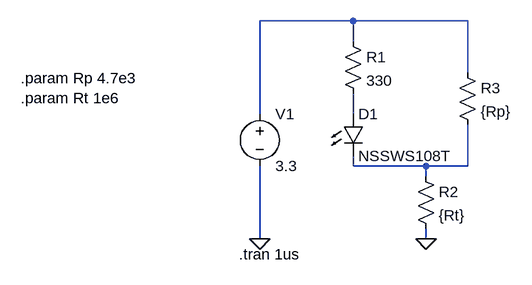
[diagram p0: schematic GpioLedWithPullup.asc]
GpioLedWithPullup.asc, the LTspice schematic file:
Version 4
SHEET 1 880 680
WIRE 192 -16 48 -16
WIRE 368 -16 192 -16
WIRE 192 16 192 -16
WIRE 368 64 368 -16
WIRE 48 128 48 -16
WIRE 192 128 192 96
WIRE 192 208 192 192
WIRE 304 208 192 208
WIRE 368 208 368 144
WIRE 368 208 304 208
WIRE 304 224 304 208
WIRE 48 320 48 208
WIRE 304 320 304 304
FLAG 48 320 0
FLAG 304 320 0
SYMBOL LED 176 128 R0
SYMATTR InstName D1
SYMATTR Value NSSWS108T
SYMATTR Description Diode
SYMATTR Type diode
SYMBOL voltage 48 112 R0
WINDOW 123 0 0 Left 0
WINDOW 39 0 0 Left 0
SYMATTR InstName V1
SYMATTR Value 3.3
SYMBOL res 176 0 R0
SYMATTR InstName R1
SYMATTR Value 330
SYMBOL res 288 208 R0
SYMATTR InstName R2
SYMATTR Value {Rt}
SYMBOL res 352 48 R0
SYMATTR InstName R3
SYMATTR Value {Rp}
TEXT 16 344 Left 0 !.tran 1us
TEXT -320 72 Left 0 !.param Rp 4.7e3\n.param Rt 1e6

The netlist it stands for:
* GpioLedWithPullup.asc
D1 N002 N003 NSSWS108T
V1 N001 0 3.3
R1 N001 N002 330
R2 N003 0 {Rt}
R3 N001 N003 {Rp}
.model D D
.lib standard.dio
.tran 1us
.param Rp 4.7e3
.param Rt 1e6
.backanno
.end